# EAGLE schematic Controle_4_reles V3 (EAGLE 4.09)

## Sheet 1 of 3
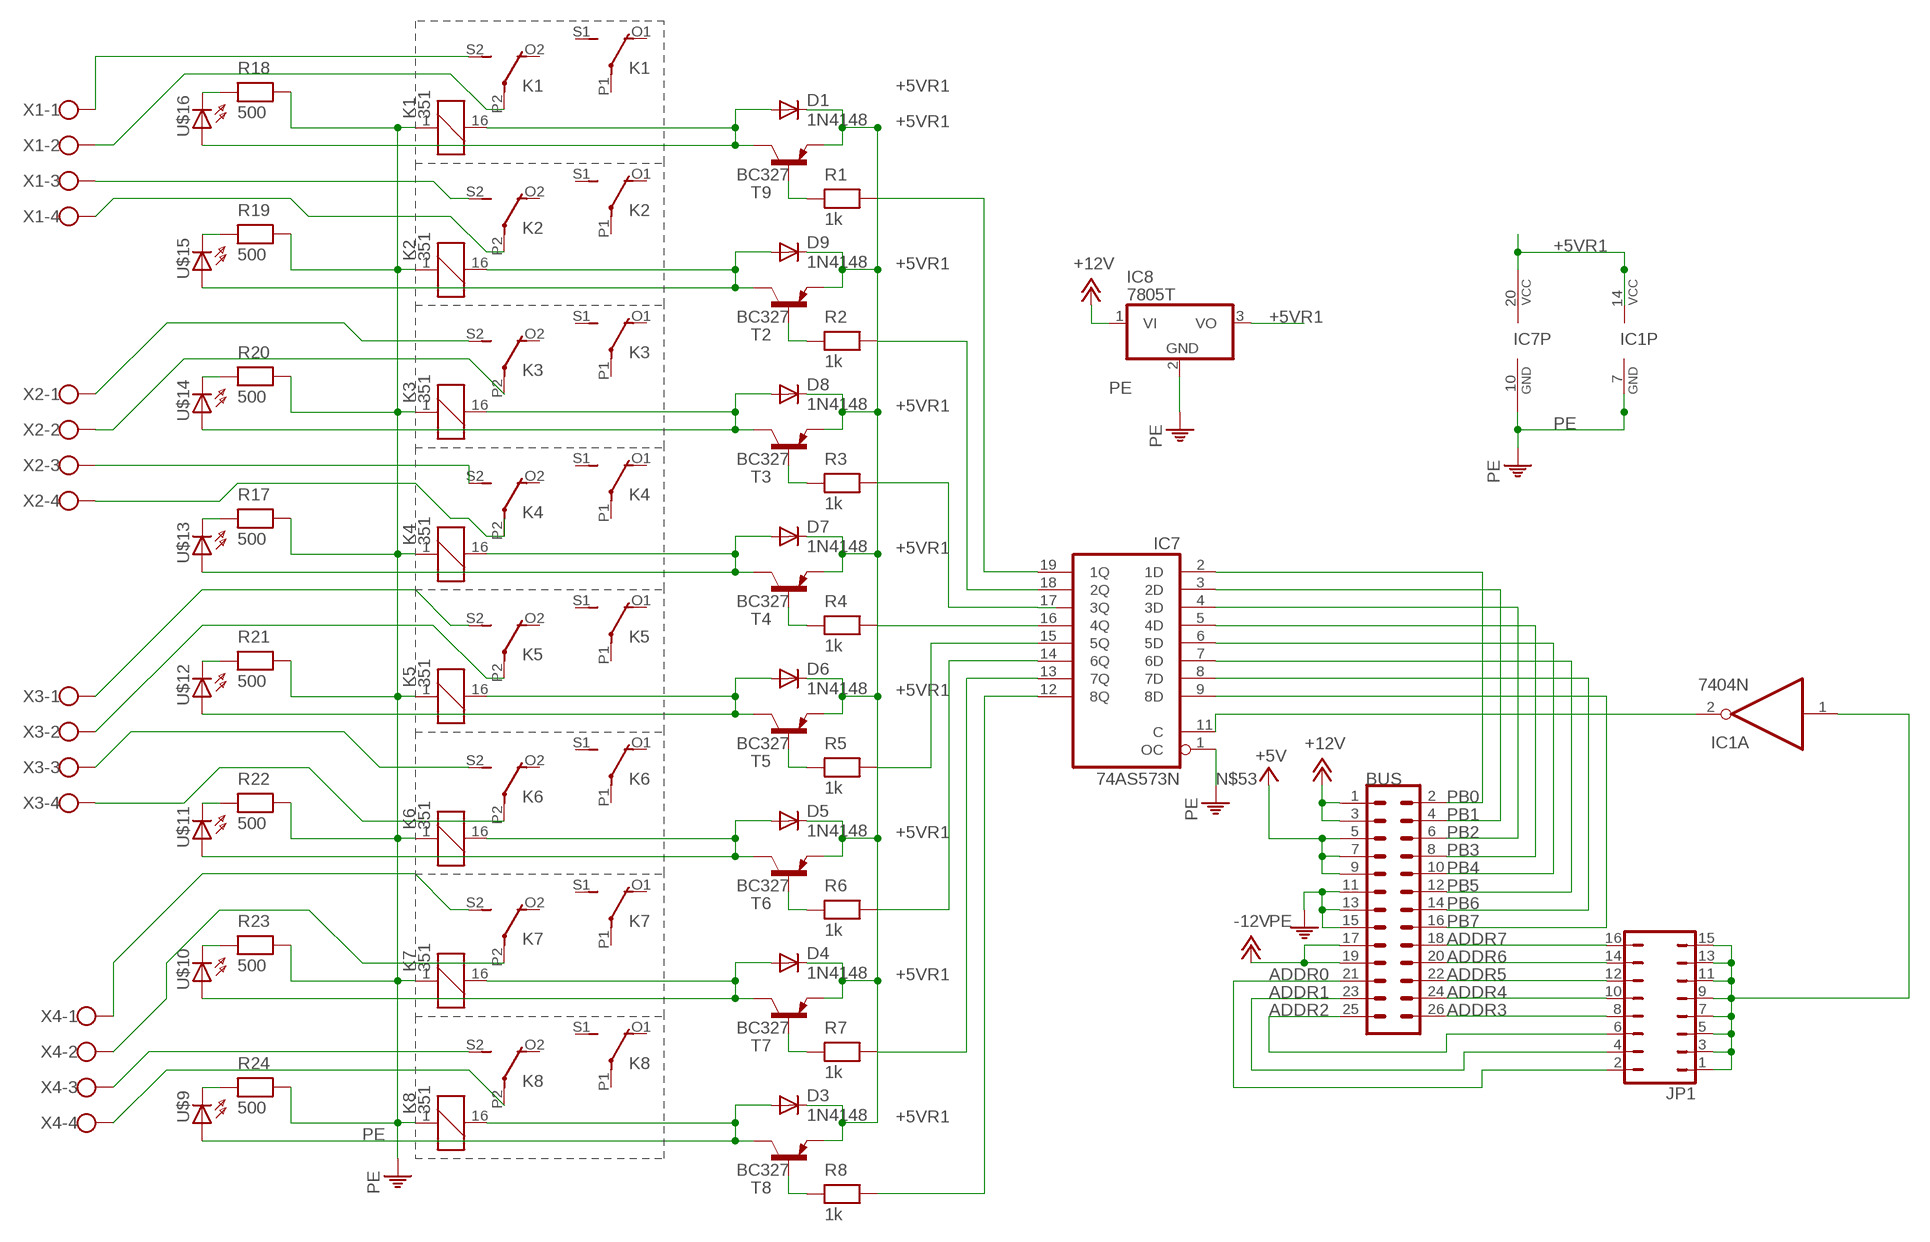
[diagram p0: schematic, sheet 1]

### Parts
BUS  ML26  [ML26]
D1  1N4148  [DO35-10]
D3  1N4148  [DO35-10]
D4  1N4148  [DO35-10]
D5  1N4148  [DO35-10]
D6  1N4148  [DO35-10]
D7  1N4148  [DO35-10]
D8  1N4148  [DO35-10]
D9  1N4148  [DO35-10]
IC1  7404N  [DIL14]
IC7  74AS573N  [DIL20]
IC8  7805T  [TO220H]
JP1  JP8Q  [JP8Q]
K1  351  [351]
K2  351  [351]
K3  351  [351]
K4  351  [351]
K5  351  [351]
K6  351  [351]
K7  351  [351]
K8  351  [351]
R1  1k  RESEU-10  [R-10]
R2  1k  RESEU-10  [R-10]
R3  1k  RESEU-10  [R-10]
R4  1k  RESEU-10  [R-10]
R5  1k  RESEU-10  [R-10]
R6  1k  RESEU-10  [R-10]
R7  1k  RESEU-10  [R-10]
R8  1k  RESEU-10  [R-10]
R17  500  RESEU-10  [R-10]
R18  500  RESEU-10  [R-10]
R19  500  RESEU-10  [R-10]
R20  500  RESEU-10  [R-10]
R21  500  RESEU-10  [R-10]
R22  500  RESEU-10  [R-10]
R23  500  RESEU-10  [R-10]
R24  500  RESEU-10  [R-10]
T2  BC327  [TO92]
T3  BC327  [TO92]
T4  BC327  [TO92]
T5  BC327  [TO92]
T6  BC327  [TO92]
T7  BC327  [TO92]
T8  BC327  [TO92]
T9  BC327  [TO92]
U$9  LED3MM  [LED3MM]
U$10  LED3MM  [LED3MM]
U$11  LED3MM  [LED3MM]
U$12  LED3MM  [LED3MM]
U$13  LED3MM  [LED3MM]
U$14  LED3MM  [LED3MM]
U$15  LED3MM  [LED3MM]
U$16  LED3MM  [LED3MM]
X1  AK500/4  [AK500/4]
X2  AK500/4  [AK500/4]
X3  AK500/4  [AK500/4]
X4  AK500/4  [AK500/4]

### Nets
+5V: BUS.5 BUS.7 BUS.9
+5VR1: D1.C D3.C D4.C D5.C D6.C D7.C D8.C D9.C IC1.14(P:VCC) IC7.20(VCC) IC8.3(VO) T2.1(E) T3.1(E) T4.1(E) T5.1(E) T6.1(E) T7.1(E) T8.1(E) T9.1(E)
+12V: BUS.1 BUS.3 IC8.1(VI)
-12V: BUS.17 BUS.19
ADDR0: BUS.21 JP1.2
ADDR1: BUS.23 JP1.4
ADDR2: BUS.25 JP1.6
ADDR3: BUS.26 JP1.8
ADDR4: BUS.24 JP1.10
ADDR5: BUS.22 JP1.12
ADDR6: BUS.20 JP1.14
ADDR7: BUS.18 JP1.16
N$1: K8.S2(3:S) X4.3
N$2: R5.1 T5.2(B)
N$3: IC7.19(1Q) R1.2
N$4: IC7.18(2Q) R2.2
N$6: IC7.16(4Q) R4.2
N$7: IC7.12(8Q) R8.2
N$8: IC7.13(7Q) R7.2
N$9: IC7.14(6Q) R6.2
N$10: R1.1 T9.2(B)
N$11: K4.P2(3:P) X2.4
N$13: IC7.17(3Q) R3.2
N$14: K3.P2(3:P) X2.2
N$15: D6.A K5.16 T5.3(C) U$12.A
N$16: K7.S2(3:S) X4.1
N$17: R2.1 T2.2(B)
N$18: D1.A K1.16 T9.3(C) U$16.A
N$19: D9.A K2.16 T2.3(C) U$15.A
N$20: R6.1 T6.2(B)
N$21: R3.1 T3.2(B)
N$22: D8.A K3.16 T3.3(C) U$14.A
N$23: D5.A K6.16 T6.3(C) U$11.A
N$24: R4.1 T4.2(B)
N$25: D7.A K4.16 T4.3(C) U$13.A
N$26: R7.1 T7.2(B)
N$27: D4.A K7.16 T7.3(C) U$10.A
N$28: R8.1 T8.2(B)
N$29: D3.A K8.16 T8.3(C) U$9.A
N$30: IC7.15(5Q) R5.2
N$31: K5.S2(3:S) X3.1
N$33: IC1.1(A:I) JP1.1 JP1.3 JP1.5 JP1.7 JP1.9 JP1.11 JP1.13 JP1.15
N$34: K6.S2(3:S) X3.3
N$35: K5.P2(3:P) X3.2
N$37: K6.P2(3:P) X3.4
N$38: K4.S2(3:S) X2.3
N$39: K8.P2(3:P) X4.4
N$40: K3.S2(3:S) X2.1
N$41: K2.P2(3:P) X1.4
N$42: K2.S2(3:S) X1.3
N$43: K1.P2(3:P) X1.2
N$44: K1.S2(3:S) X1.1
N$45: K7.P2(3:P) X4.2
N$51: R18.1 U$16.K(C)
N$53: IC1.2(A:O) IC7.11(C)
N$94: R20.1 U$14.K(C)
N$95: R19.1 U$15.K(C)
N$98: R17.1 U$13.K(C)
N$150: R21.1 U$12.K(C)
N$153: R22.1 U$11.K(C)
N$156: R23.1 U$10.K(C)
N$160: R24.1 U$9.K(C)
PB0: BUS.2 IC7.2(1D)
PB1: BUS.4 IC7.3(2D)
PB2: BUS.6 IC7.4(3D)
PB3: BUS.8 IC7.5(4D)
PB4: BUS.10 IC7.6(5D)
PB5: BUS.12 IC7.7(6D)
PB6: BUS.14 IC7.8(7D)
PB7: BUS.16 IC7.9(8D)
PE: BUS.11 BUS.13 BUS.15 IC1.7(P:GND) IC7.1(OC) IC7.10(GND) IC8.2(GND) K1.1 K2.1 K3.1 K4.1 K5.1 K6.1 K7.1 K8.1 R17.2 R18.2 R19.2 R20.2 R21.2 R22.2 R23.2 R24.2
Unconnected: IC1.3(B:I) IC1.4(B:O) IC1.5(C:I) IC1.6(C:O) IC1.8(D:O) IC1.9(D:I) IC1.10(E:O) IC1.11(E:I) IC1.12(F:O) IC1.13(F:I) K1.O1(2:O) K1.O2(3:O) K1.P1(2:P) K1.S1(2:S) K2.O1(2:O) K2.O2(3:O) K2.P1(2:P) K2.S1(2:S) K3.O1(2:O) K3.O2(3:O) K3.P1(2:P) K3.S1(2:S) K4.O1(2:O) K4.O2(3:O) K4.P1(2:P) K4.S1(2:S) K5.O1(2:O) K5.O2(3:O) K5.P1(2:P) K5.S1(2:S) K6.O1(2:O) K6.O2(3:O) K6.P1(2:P) K6.S1(2:S) K7.O1(2:O) K7.O2(3:O) K7.P1(2:P) K7.S1(2:S) K8.O1(2:O) K8.O2(3:O) K8.P1(2:P) K8.S1(2:S)

## Sheet 2 of 3

## Sheet 3 of 3

## Library data of the parts
BUS = con-harting-ml:ML26: HARTING
D1 D3-D9 = diode:1N4148: DIODE high speed (Philips)
IC1 = 74xx-us:74*04: Hex INVERTER
IC7 = 74xx-us:74*573: 8-bit D latch BUS DRIVER
IC8 = linear:78*: Positive VOLTAGE REGULATOR
JP1 = jumper:JP8Q: JUMPER
K1-K8 = relay:351: RELAY 2 x switch, Omron
R1-R8 R17-R24 = discrete:RESEU-10
T2-T9 = transistor-pnp:BC327: PNP Transistor
U$9-U$16 = led:LED: LED
X1-X4 = con-ptr500:AK500/4: CONNECTOR